# Altium schematic sheet main.SchDoc: HMI panel
size A4
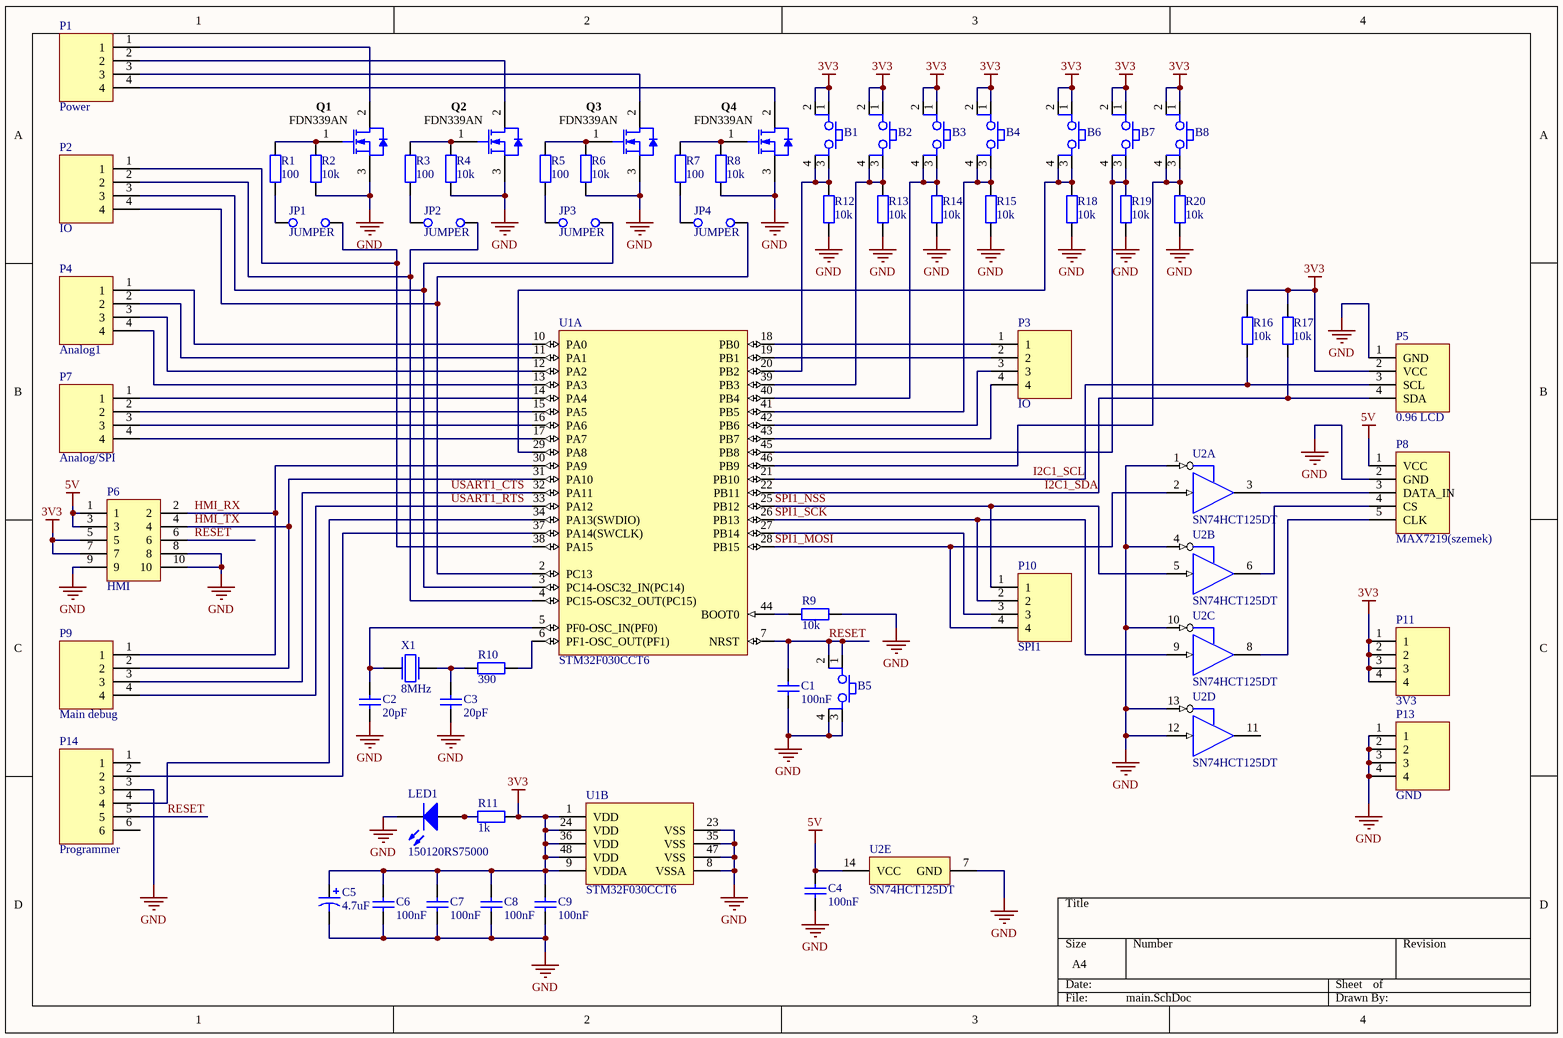
[diagram p0: main.SchDoc]

## Parts
B1  Button  [FP_BTN_SMD]  (value not drawn)
B2  Button  [FP_BTN_SMD]  (value not drawn)
B3  Button  [FP_BTN_SMD]  (value not drawn)
B4  Button  [FP_BTN_SMD]  (value not drawn)
B5  Button  [FP_BTN_SMD]  (value not drawn)
B6  Button  [FP_BTN_SMD]  (value not drawn)
B7  Button  [FP_BTN_SMD]  (value not drawn)
B8  Button  [FP_BTN_SMD]  (value not drawn)
C1  100nF  [FP_1206_CAP_125]
C2  20pF  [FP_1206_CAP_125]
C3  20pF  [FP_1206_CAP_125]
C4  100nF  [FP_1206_CAP_125]
C5  4.7uF  [FP_3528]
C6  100nF  [FP_0805_CAP_085]
C7  100nF  [FP_0805_CAP_085]
C8  100nF  [FP_0805_CAP_085]
C9  100nF  [FP_0805_CAP_085]
JP1  JUMPER  [FP_CONN2_TUSKE_2MM_1.5+3.2]
JP2  JUMPER  [FP_CONN2_TUSKE_2MM_1.5+3.2]
JP3  JUMPER  [FP_CONN2_TUSKE_2MM_1.5+3.2]
JP4  JUMPER  [FP_CONN2_TUSKE_2MM_1.5+3.2]
LED1  150120RS75000  [1206_A]
P1  Power  [FP_CONN4_TAP_254MM]
P2  IO  [FP_CONN4_TAP_254MM]
P3  IO  [FP_CONN4_TAP_254MM]
P4  Analog1  [FP_CONN4_TAP_254MM]
P5  0.96 LCD  [FP_CONN4_TAP_254MM]
P6  HMI  [FP_CONN10]
P7  Analog/SPI  [FP_CONN4_TAP_254MM]
P8  MAX7219(szemek)  [FP_CONN5_TAP_254MM]
P9  Main debug  [FP_CONN4_TAP_254MM]
P10  SPI1  [FP_CONN4_TAP_254MM]
P11  3V3  [FP_CONN4_TAP_254MM]
P13  GND  [FP_CONN4_TAP_254MM]
P14  Programmer  [FP_CONN6_TAP_254MM]
Q1  FDN339AN  [FAIR-SOT-3_V]
Q2  FDN339AN  [FAIR-SOT-3_V]
Q3  FDN339AN  [FAIR-SOT-3_V]
Q4  FDN339AN  [FAIR-SOT-3_V]
R1  100  [FP_0805_RES]
R2  10k  [FP_0805_RES]
R3  100  [FP_0805_RES]
R4  10k  [FP_0805_RES]
R5  100  [FP_0805_RES]
R6  10k  [FP_0805_RES]
R7  100  [FP_0805_RES]
R8  10k  [FP_0805_RES]
R9  10k  [FP_1206_RES]
R10  390  [FP_1206_RES]
R11  1k  [FP_1206_RES]
R12  10k  [FP_1206_RES]
R13  10k  [FP_1206_RES]
R14  10k  [FP_1206_RES]
R15  10k  [FP_1206_RES]
R16  10k  [FP_1206_RES]
R17  10k  [FP_1206_RES]
R18  10k  [FP_1206_RES]
R19  10k  [FP_1206_RES]
R20  10k  [FP_1206_RES]
U1  STM32F030CCT6  [STM-LQFP48_M]  (parts A,B of 2)
U2  SN74HCT125DT  [D0014A_N]  (parts A,B,C,D,E of 5)
X1  8MHz  [FP_CRYSTAL_HC49_SMD]

## Nets
3V3: B1.1 B1.2 B2.1 B2.2 B3.1 B3.2 B4.1 B4.2 B6.1 B6.2 B7.1 B7.2 B8.1 B8.2 C5.P C6.2 C7.2 C8.2 C9.2 P5.2(VCC) P6.5 P6.7 P11.1 P11.2 P11.3 P11.4 R11.2 R16.2 R17.2 U1.1(VDD) U1.9(VDDA) U1.24(VDD) U1.36(VDD) U1.48(VDD)
5V: C4.2 P6.1 P6.3 P8.1(VCC) U2.14(VCC)
GND: B5.3 B5.4 C1.1 C2.1 C3.1 C4.1 C5.N C6.1 C7.1 C8.1 C9.1 LED1.1(K) P5.1(GND) P6.8 P6.9 P6.10 P8.2(GND) P13.1 P13.2 P13.3 P13.4 P14.3 Q1.3(S) Q2.3(S) Q3.3(S) Q4.3(S) R2.1 R4.1 R6.1 R8.1 R9.2 R12.1 R13.1 R14.1 R15.1 R18.1 R19.1 R20.1 U1.8(VSSA) U1.23(VSS) U1.35(VSS) U1.47(VSS) U2.1(1~{OE}) U2.4(2~{OE}) U2.7(GND) U2.10(3~{OE}) U2.12(4A) U2.13(4~{OE})
HMI_RX: P6.2 P9.1 U1.30(PA9)
HMI_TX: P6.4 P9.2 U1.31(PA10)
I2C1_SCL: P5.3(SCL) R16.1 U1.21(PB10)
I2C1_SDA: P5.4(SDA) R17.1 U1.22(PB11)
RESET: B5.1 B5.2 C1.2 P6.6 P14.5 U1.7(NRST)
SPI1_MOSI: P10.4 U1.28(PB15) U2.2(1A)
SPI1_NSS: P10.1 U1.25(PB12) U2.5(2A)
SPI1_SCK: P10.2 U1.26(PB13) U2.9(3A)
USART1_CTS: P9.3 U1.32(PA11)
USART1_RTS: P9.4 U1.33(PA12)
NetB1_3: B1.3 B1.4 R12.2 U1.20(PB2)
NetB2_3: B2.3 B2.4 R13.2 U1.39(PB3)
NetB3_3: B3.3 B3.4 R14.2 U1.40(PB4)
NetB4_3: B4.3 B4.4 R15.2 U1.41(PB5)
NetB6_3: B6.3 B6.4 R18.2 U1.29(PA8)
NetB7_3: B7.3 B7.4 R19.2 U1.45(PB8)
NetB8_3: B8.3 B8.4 R20.2 U1.46(PB9)
NetC2_2: C2.2 U1.5(PF0-OSC_IN(PF0)) X1.1
NetC3_2: C3.2 R10.1 X1.2
NetJP1_1: JP1.1(C1) R1.1
NetJP1_2: JP1.2(C2) P2.1 U1.38(PA15)
NetJP2_1: JP2.1(C1) R3.1
NetJP2_2: JP2.2(C2) P2.2 U1.4(PC15-OSC32_OUT(PC15))
NetJP3_1: JP3.1(C1) R5.1
NetJP3_2: JP3.2(C2) P2.3 U1.3(PC14-OSC32_IN(PC14))
NetJP4_1: JP4.1(C1) R7.1
NetJP4_2: JP4.2(C2) P2.4 U1.2(PC13)
NetLED1_2: LED1.2(A) R11.1
NetP1_1: P1.1 Q1.2(D)
NetP1_2: P1.2 Q2.2(D)
NetP1_3: P1.3 Q3.2(D)
NetP1_4: P1.4 Q4.2(D)
NetP3_1: P3.1 U1.18(PB0)
NetP3_2: P3.2 U1.19(PB1)
NetP3_3: P3.3 U1.42(PB6)
NetP3_4: P3.4 U1.43(PB7)
NetP4_1: P4.1 U1.10(PA0)
NetP4_2: P4.2 U1.11(PA1)
NetP4_3: P4.3 U1.12(PA2)
NetP4_4: P4.4 U1.13(PA3)
NetP7_1: P7.1 U1.14(PA4)
NetP7_2: P7.2 U1.15(PA5)
NetP7_3: P7.3 U1.16(PA6)
NetP7_4: P7.4 U1.17(PA7)
NetP8_3: P8.3(DATA_IN) U2.3(1Y)
NetP8_4: P8.4(CS) U2.6(2Y)
NetP8_5: P8.5(CLK) U2.8(3Y)
NetP10_3: P10.3 U1.27(PB14)
NetP14_2: P14.2 U1.37(PA14(SWCLK))
NetP14_4: P14.4 U1.34(PA13(SWDIO))
NetQ1_1: Q1.1(G) R1.2 R2.2
NetQ2_1: Q2.1(G) R3.2 R4.2
NetQ3_1: Q3.1(G) R5.2 R6.2
NetQ4_1: Q4.1(G) R7.2 R8.2
NetR9_1: R9.1 U1.44(BOOT0)
NetR10_2: R10.2 U1.6(PF1-OSC_OUT(PF1))

Not connected (* = marked no-connect by the designer): P14 1 6; U2 11(4Y)

## Library data of the parts
B1-B8 = Button 4P: Push button
C1-C4 C6-C9 = CAP: Capacitor
  C1 C4 C6-C9: Value: 100nF
  C2 C3: Value: 20pF
C5 = CAP_ELECT: Polarized Capacitor; Value: 4.7uF
JP1-JP4 = JUMPER: Jumper Wire
LED1 = CMP-1426-00013-1: SMD mono-color Chip LED, WL-SMCW, Red; Manufacturer: Wuerth Elektronik; Color: Red; ComponentLink2URL: http://katalog.we-online.com/led/datasheet/150120RS75000.pdf; ComponentLink2Description: Datasheet; ComponentLink1Description: Manufacturer URL; ComponentLink1URL: http://www.we-online.com; PartNumber: 150120RS75000; PackageReference: 1206_A
P1-P5 P7 P9-P11 P13 = Connector_4pin: 4pin Connector
P6 = Connector_10pin: 10pin Connector
P8 = Connector_5pin: 5pin Connector
P14 = Connector_6pin: 6pin connector
Q1-Q4 = CMP-2000-06252-1: N-Channel Specified PowerTrench(R) MOSFET, 3 A, 20 V, -55 to 150 degC, 3-Pin SOT, RoHS, Tape and Reel; Manufacturer: Fairchild Semiconductor; Typical Turn-On Delay Time: 8ns; Transistor Configuration: Single; Maximum Drain Source Resistance: 0.035Ω; Transistor Material: Si; Minimum Gate Threshold Voltage: 0.4V; Typical Input Capacitance @ Vds: 700pF@10V; Maximum Gate Source Voltage: ±8V; Typical Gate Charge @ Vgs: 7nC@4.5V; Channel Mode: Enhancement; Channel Type: N; Maximum Continuous Drain Current: 3A; Typical Turn-Off Delay Time: 18ns; Number of Elements per Chip: 1; Maximum Drain Source Voltage: 20V; Maximum Power Dissipation: 0.5W; Length: 2.92mm; Datasheet Version: 11/1999; Datasheet URL: https://www.fairchildsemi.com/datasheets/FD/FDN339AN.pdf; Pin Count: 3; Package Reference: SOT-3; Mounting Technology: SurfaceMount; Manufacturer URL: https://www.fairchildsemi.com/; Package URL: https://www.fairchildsemi.com/package-drawings/MA/MA03B.pdf; Package Type: SOT-23; Mounting Type: SurfaceMount; Dimensions: 2.92x1.4x0.94mm; Width: 1.4mm; Maximum Operating Temperature: +150°C; Category: PowerMOSFET; Minimum Operating Temperature: -55°C; Package Description: 3-Pin Small Outline Transistor, Body 2.92 x 1.4 mm, Pitch 0.95 mm; Height: 0.94mm
R1-R20 = RES: Resistor
  R1 R3 R5 R7: Value: 100
  R2 R4 R6 R8 R9 R12-R20: Value: 10k
  R10: Value: 390
  R11: Value: 1k
U1 = CMP-0304-00065-1: ARM Cortex-M0 32-bit MCU, 256 KB Flash, 32 KB Internal RAM, 38 I/Os, 48-Pin LQFP, -40 to 85 degC, Tray; FLASH Size (Prog) (kB): 256; Operating Frequency(F) (Processor speed) (MHz): 48; Supply Voltage(Vcc) min (V): 2.4; Internal RAM Size (kB): 32; I/Os (High Current): 38; DatasheetVersion: Rev. 2; Mounting Technology: Surface Mount; Packing: Tray; Package Reference: LQFP48; Core: ARM Cortex-M0; ComponentLink1URL: http://www.st.com/; Package Description: 48-Pin Low Profile Quad Flat Package, Body 7 x 7 mm, Pitch 0.5 mm; ComponentLink2Description: Datasheet; ComponentLink2URL: http://www.st.com/st-web-ui/static/active/en/resource/technical/document/datasheet/DM00088500.pdf; ComponentLink1Description: Manufacturer URL; PartId: 1
U2 = CMP-0440-00008-3: Quadruple Bus Buffer Gates With 3-State Outputs, D0014A, SMALL T&R; Manufacturer: Texas Instruments; F @ Nom Voltage(Max)(Mhz): 25; Bits(#): 4; VCC(Max)(V): 5.5; VCC(Min)(V): 4.5; tpd @ Nom Voltage(Max)(ns): 30; Input Type: TTL; Rating: Catalog; Output Type: CMOS; ICC @ Nom Voltage(Max)(mA): 0.08; Voltage(Nom)(V): 5; DatasheetVersion: SCLS069E; PackageVersion: http://www.ti.com/lit/ml/mpds177g/mpds177g.pdf; Code_JEDEC: MS-012; Operating Temperature Range(C): -40 to 85; PackageReference: D0014A; Generic Part Number: SN74HCT125; PartId: 1
X1 = Crystal: Quarz Crystal; Value: 8MHz